# Altium schematic sheet 1_V6.schdoc
size 713 x 330 mm; Name: A_A3; Symbol: A_A3; Device: A_A3; @Project Name: samrtclick; REV: 1; Date: 2023-02-28; Sheet: 1/1; Draw By: kano; Company: Your Company; Convert to PCB: yes; Add into BOM: yes; @Update Date: 2023-06-25; @Page No: 1; @Page Count: 1; @Schematic Name: V6; @Page Name: V6
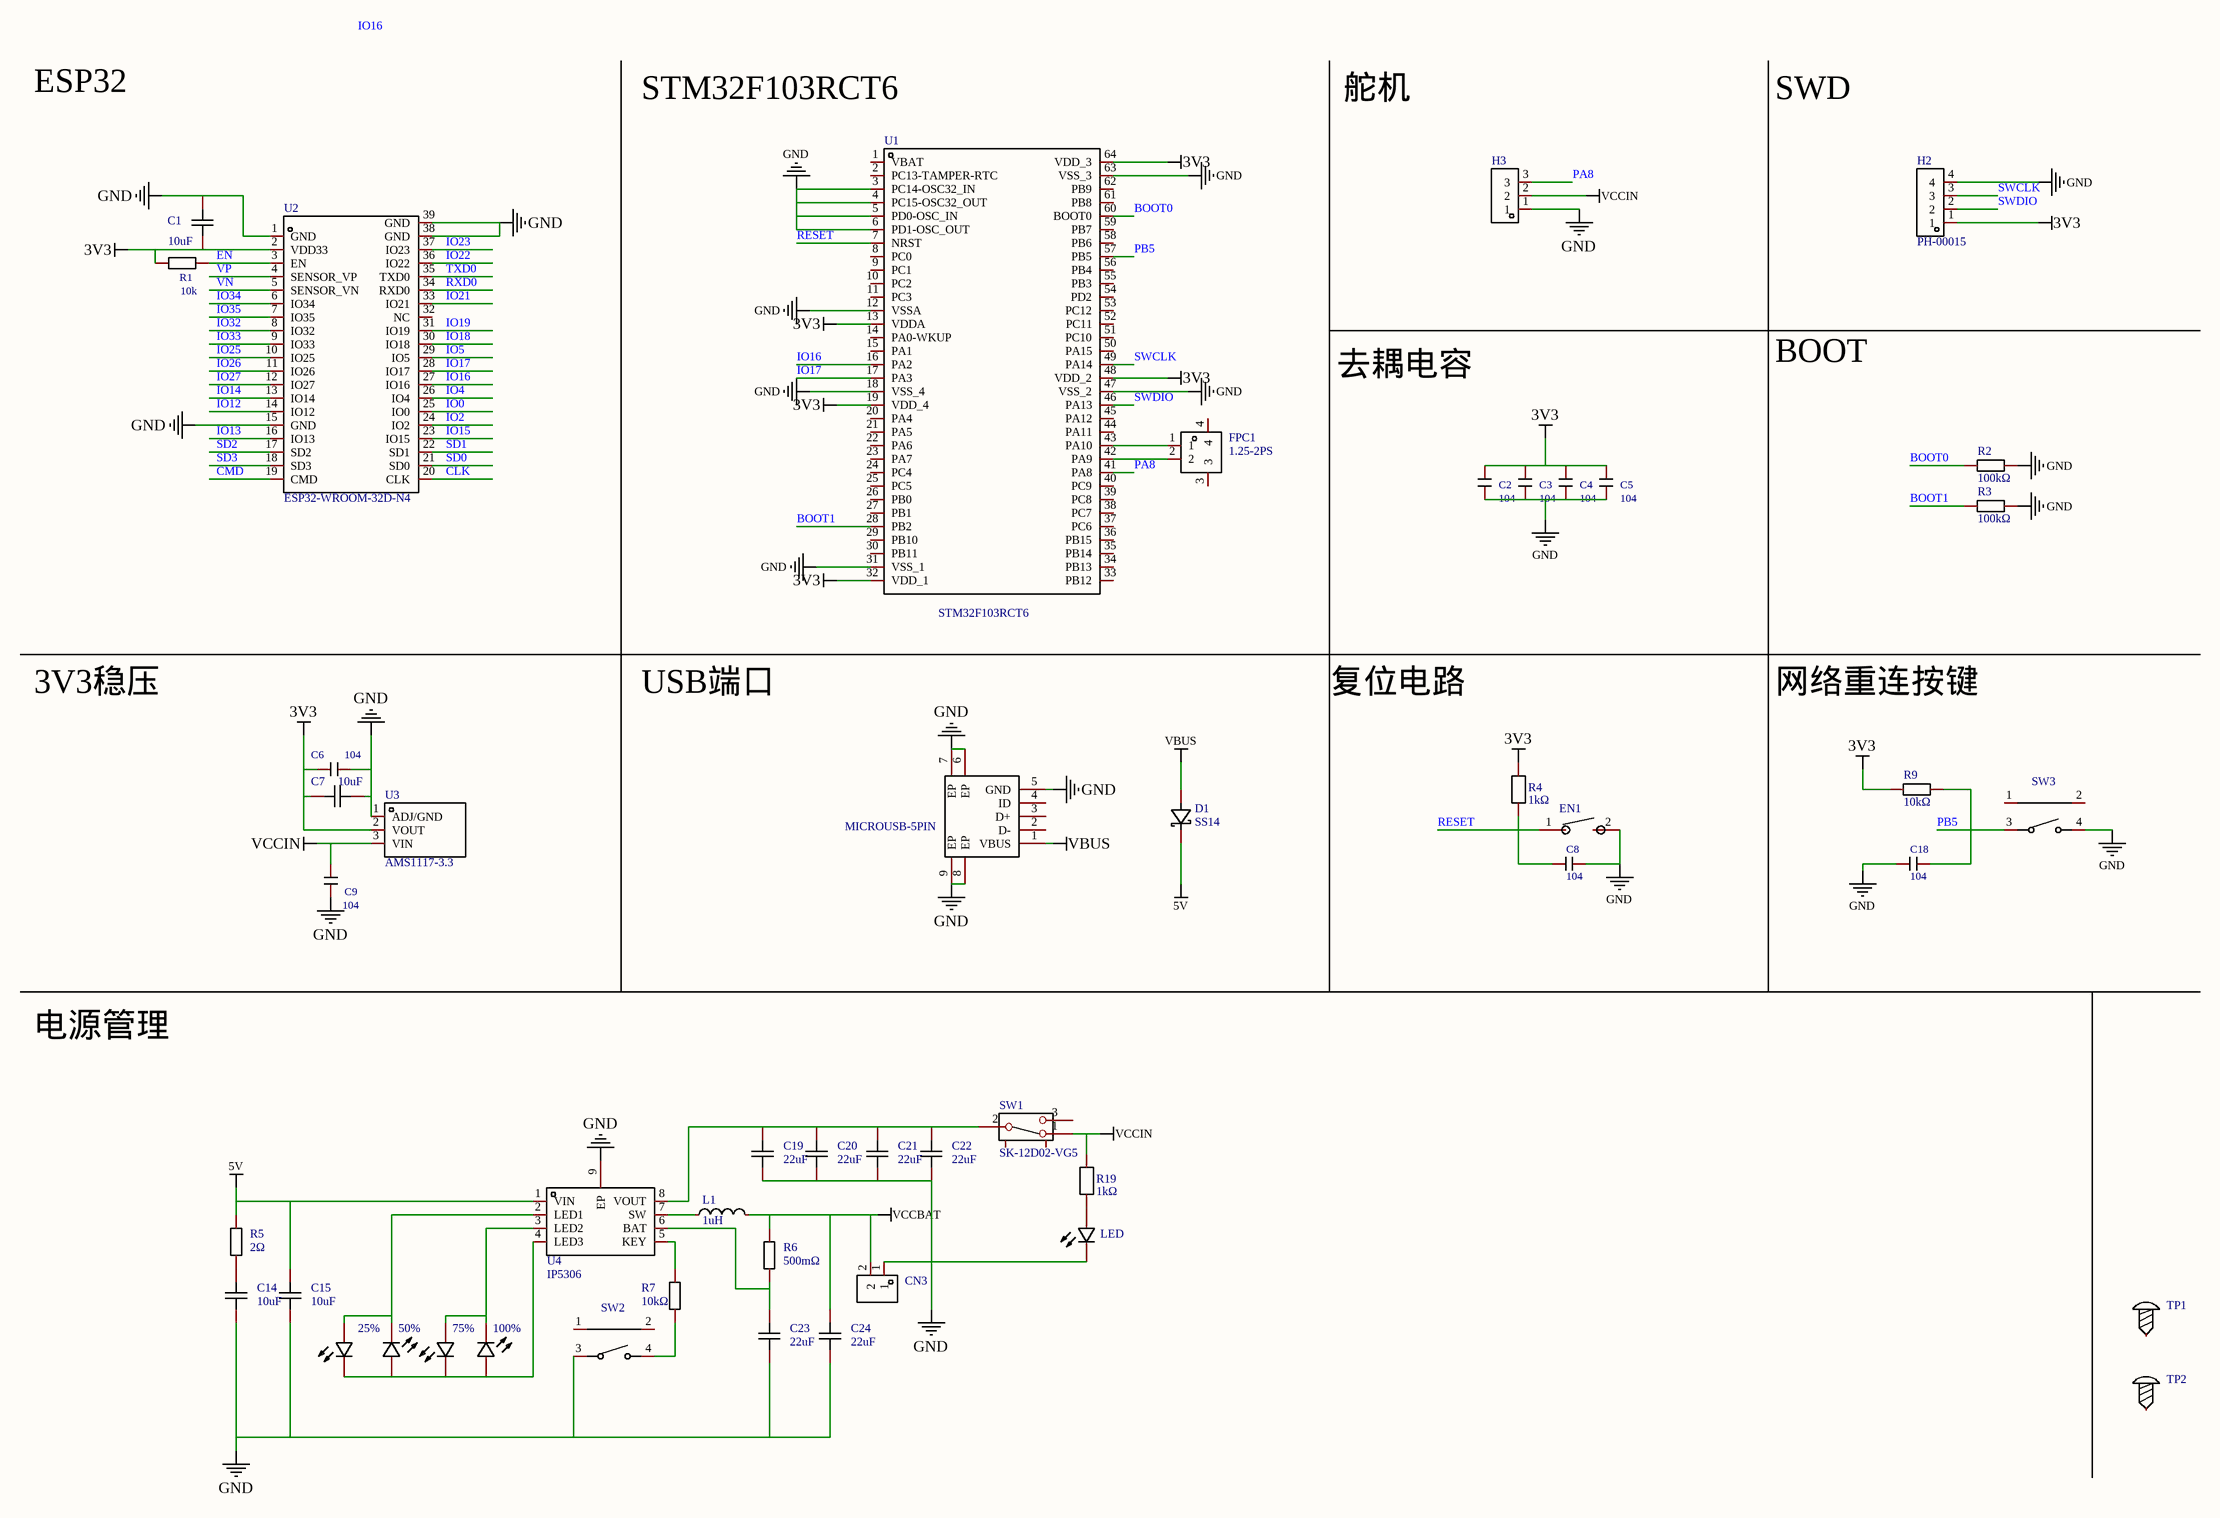
[diagram p0: 1_V6.schdoc]

## Parts
25%  19-217/GHC-YR1S2/3T  [LED0603-RD]  (value not drawn)
50%  19-217/GHC-YR1S2/3T  [LED0603-RD]  (value not drawn)
75%  19-217/GHC-YR1S2/3T  [LED0603-RD]  (value not drawn)
100%  19-217/GHC-YR1S2/3T  [LED0603-RD]  (value not drawn)
C1  10uF  [C0603]
C2  104  [C0603]
C3  104  [C0603]
C4  104  [C0603]
C5  104  [C0603]
C6  104  [C0603]
C7  10uF  [C0805]
C8  104  [C0603]
C9  104  [C0603]
C14  10uF  [C0805]
C15  10uF  [C0805]
C18  104  [C0603]
C19  22uF  [C0805]
C20  22uF  [C0805]
C21  22uF  [C0805]
C22  22uF  [C0805]
C23  22uF  [C0805]
C24  22uF  [C0805]
CN3  HX25003-2A  [CONN-TH_2P-P2.50_HX25003-2A]  (value not drawn)
D1  SS14  [SOD-123FL_L2.8-W1.8-LS3.7-RD]
EN1  TSA343G00-250J2  [SW-SMD_L4.0-W2.9-LS5.0]  (value not drawn)
FPC1  1.25-2PS  [CONN-SMD_2P-P1.25_DEALON_1.25-2PS]
H2  PH-00015  [HDR-TH_4P-P2.54-V-M]
H3  Z-211-0311-0021-001  [HDR-TH_3P-P2.54-V-M-1]  (value not drawn)
L1  1uH  [IND-SMD_L7.0-W6.6]
LED  19-217/GHC-YR1S2/3T  [LED0603-RD]  (value not drawn)
NO1  MICROUSB-5PIN  [USB-SMD_5P_MICROUSB-5PIN]
R1  10k  [R0603]
R2  100kΩ  [R0603]
R3  100kΩ  [R0603]
R4  1kΩ  [R0603]
R5  2Ω  [R0805]
R6  500mΩ  [R1206]
R7  10kΩ  [R0603]
R9  10kΩ  [R0603]
R19  1kΩ  [R0603]
SW1  SK-12D02-VG5  [SW-TH_SK-12D02-VG5]
SW2  TS24CA  [SW-SMD_TS24CA]  (value not drawn)
SW3  TS24CA  [SW-SMD_TS24CA]  (value not drawn)
TP1  M2螺丝  [M2螺丝]  (value not drawn)
TP2  M2螺丝  [M2螺丝]  (value not drawn)
U1  STM32F103RCT6  [LQFP-64_L10.0-W10.0-P0.50-LS12.0-BL]
U2  ESP32-WROOM-32D-N4  [WIFIM-SMD_39P-L25.5-W18.0-P1.27-BL]
U3  AMS1117-3.3  [SOT-89-3_L4.5-W2.5-P1.50-LS4.2-BR]
U4  IP5306  [ESOP-8_L4.9-W3.9-P1.27-LS6.0-BL-EP]

## Nets
3V3: C1.1 C2.1 C3.1 C4.1 C5.1 C6.2 C7.1 H2.1 R1.1 R4.1 R9.2 U1.13(VDDA) U1.19(VDD_4) U1.32(VDD_1) U1.48(VDD_2) U1.64(VDD_3) U2.2(VDD33) U3.2(VOUT)
5V: C15.2 D1.1(A) R5.2 U4.1(VIN)
GND: C1.2 C2.2 C3.2 C4.2 C5.2 C6.1 C7.2 C8.1 C9.1 C14.1 C15.1 C18.1 C19.2 C20.2 C21.2 C22.2 C23.2 C24.2 CN3.1 EN1.2 H2.4 H3.1 LED.1(C) NO1.5(GND) NO1.6(EP) NO1.7(EP) NO1.8(EP) NO1.9(EP) R2.2 R3.2 SW2.3 SW3.4 U1.3(PC14-OSC32_IN) U1.4(PC15-OSC32_OUT) U1.5(PD0-OSC_IN) U1.6(PD1-OSC_OUT) U1.12(VSSA) U1.18(VSS_4) U1.31(VSS_1) U1.47(VSS_2) U1.63(VSS_3) U2.1(GND) U2.15(GND) U2.38(GND) U2.39(GND) U3.1(ADJ/GND) U4.9(EP)
VBUS: D1.2(K) NO1.1(VBUS)
VCCBAT: C24.1 CN3.2 L1.2 R6.2
VCCIN: C9.2 H3.2 R19.1 SW1.1 U3.3(VIN)
BOOT0: R2.1 U1.60(BOOT0)
BOOT1: R3.1 U1.28(PB2)
CLK: U2.20(CLK)
CMD: U2.19(CMD)
EN: R1.2 U2.3(EN)
IO0: U2.25(IO0)
IO2: U2.24(IO2)
IO4: U2.26(IO4)
IO5: U2.29(IO5)
IO12: U2.14(IO12)
IO13: U2.16(IO13)
IO14: U2.13(IO14)
IO15: U2.23(IO15)
IO16: U1.16(PA2) U2.27(IO16)
IO17: U1.17(PA3) U2.28(IO17)
IO18: U2.30(IO18)
IO19: U2.31(IO19)
IO21: U2.33(IO21)
IO22: U2.36(IO22)
IO23: U2.37(IO23)
IO25: U2.10(IO25)
IO26: U2.11(IO26)
IO27: U2.12(IO27)
IO32: U2.8(IO32)
IO33: U2.9(IO33)
IO34: U2.6(IO34)
IO35: U2.7(IO35)
PA8: H3.3 U1.41(PA8)
PB5: C18.2 R9.1 SW3.3 U1.57(PB5)
RESET: C8.2 EN1.1 R4.2 U1.7(NRST)
RXD0: U2.34(RXD0)
SD0: U2.21(SD0)
SD1: U2.22(SD1)
SD2: U2.17(SD2)
SD3: U2.18(SD3)
SWCLK: H2.3 U1.49(PA14)
SWDIO: H2.2 U1.46(PA13)
TXD0: U2.35(TXD0)
VN: U2.5(SENSOR_VN)
VP: U2.4(SENSOR_VP)
Net25%_1: 25%.1(C) 50%.2(A) 75%.1(C) 100%.2(A) U4.4(LED3)
Net25%_2: 25%.2(A) 50%.1(C) U4.2(LED1)
Net75%_2: 75%.2(A) 100%.1(C) U4.3(LED2)
NetC14_2: C14.2 R5.1
NetC19_1: C19.1 C20.1 C21.1 C22.1 SW1.2 U4.8(VOUT)
NetC23_1: C23.1 R6.1 U4.6(BAT)
NetFPC1_1: FPC1.1 U1.43(PA10)
NetFPC1_2: FPC1.2 U1.42(PA9)
NetL1_1: L1.1 U4.7(SW)
NetLED_2: LED.2(A) R19.2
NetR7_1: R7.1 SW2.4
NetR7_2: R7.2 U4.5(KEY)

Not connected (* = marked no-connect by the designer): FPC1 3 4; NO1 2(D-) 3(D+) 4(ID); SW1 3 4 5; SW2 1 2; SW3 1 2; TP1 1; TP2 1; U1 1(VBAT) 2(PC13-TAMPER-RTC) 8(PC0) 9(PC1) 10(PC2) 11(PC3) 14(PA0-WKUP) 15(PA1) 20(PA4) 21(PA5) 22(PA6) 23(PA7) 24(PC4) 25(PC5) 26(PB0) 27(PB1) 29(PB10) 30(PB11) 33(PB12) 34(PB13) 35(PB14) 36(PB15) 37(PC6) 38(PC7) 39(PC8) 40(PC9) 44(PA11) 45(PA12) 50(PA15) 51(PC10) 52(PC11) 53(PC12) 54(PD2) 55(PB3) 56(PB4) 58(PB6) 59(PB7) 61(PB8) 62(PB9); U2 32(NC)

## Notes on the sheet
- ESP32
- STM32F103RCT6
- 舵机
- SWD
- BOOT
- 去耦电容
- 3V3稳压
- USB端口
- 复位电路
- 网络重连按键
- 电源管理
- Labels drawn without touching a wire or pin: IO16
- 2023-06-25
- 1
- V6
- 2
- 3
- 4
- 5
- 6
- 7
- 8
- A
- B
- C
- D
- E
- TITLE:
- REV:
- Date:
- Company:
- Drawn By:
- Sheet:

## Library data of the parts
25% 50% 75% 100% LED = 19-217/GHC-YR1S2/3T: 发光颜色:翠绿;二极管配置:-;主波长:520nm~535nm;色温:-;功率:110mW;安装方式:-;; Manufacturer: EVERLIGHT(亿光); Add into BOM: yes; Emitted Color: 翠绿; Lens Color: 无色透明; Peak Wavelength: 518nm; Forward Current: 20mA; Power Dissipation: 110mW; Viewing Angle: 120°; Name: 19-217/GHC-YR1S2/3T; Symbol: 19-217/GHC-YR1S2/3T; Device: 19-217/GHC-YR1S2/3T; LCSC Part Name: 19-217/GHC-YR1S2/3T; Supplier Part: C72043; Manufacturer Part: 19-217/GHC-YR1S2/3T; Supplier Footprint: 0603; JLCPCB Part Class: Basic Part; Datasheet: https://atta.szlcsc.com/upload/public/pdf/source/20160507/1462613613780.pdf; Supplier: LCSC; Convert to PCB: yes; Diode Configuration: -; Dominant Wavelength: 520nm~535nm; Color Temperature: -; Mounting Sytle: -; Operating Temperature: -40℃~+85℃
C1 = 10uF: 3DModel: C0603_L1.6-W0.8-H0.8; Add into BOM: yes; Name: 10uF; Symbol: 10uF; Device: 10uF; link: https://item.szlcsc.com/362304.html; Convert to PCB: yes; Origin Footprint: C0603
C2-C6 C8 C9 C18 = 104: 3DModel: C0603_L1.6-W0.8-H0.8; BOM名称: 无极性贴片电容; 版权归属: 源创客; Add into BOM: yes; Name: 104; Symbol: 104; Device: 104; link: https://item.szlcsc.com/362304.html; 学习资源: www.ooocke.com; Convert to PCB: yes; Origin Footprint: C0603
C7 = 10uF: 3DModel: C0805_L2.0-W1.3-H1.3; Add into BOM: yes; Name: 10uF; Symbol: 10uF; Device: 10uF; link: https://item.szlcsc.com/373011.html; Convert to PCB: yes; Origin Footprint: C0805
C14 C15 = GRM21BR61H106KE43L: 容值:10uF;精度:±10%;额定电压:50V;材质(温度系数):X5R;; Manufacturer: muRata(村田); Add into BOM: yes; Tolerance: ±10%; Voltage Rated: 50V; Temperature Coefficient: X5R; Name: 10uF; Symbol: GRM21BR61H106KE43L; Device: GRM21BR61H106KE43L; LCSC Part Name: 10uF ±10% 50V; Supplier Part: C440198; Manufacturer Part: GRM21BR61H106KE43L; Supplier Footprint: 0805; JLCPCB Part Class: Basic Part; Datasheet: https://atta.szlcsc.com/upload/public/pdf/source/20191220/C440198_2DEA1B9834E321C8893F7972E9DFE5B0.pdf; Supplier: LCSC; Convert to PCB: yes; Value: 10uF
C19-C24 = C2012X5R1V226MT000E: 容值:22uF;精度:±20%;额定电压:35V;材质(温度系数):X5R;; Manufacturer: TDK; Add into BOM: yes; Tolerance: ±20%; Voltage Rated: 35V; Temperature Coefficient: X5R; Name: 22uF; Symbol: C2012X5R1V226MT000E; Device: C2012X5R1V226MT000E; LCSC Part Name: 22uF ±20% 35V; Supplier Part: C338080; Manufacturer Part: C2012X5R1V226MT000E; Supplier Footprint: 0805; JLCPCB Part Class: Extended Part; Datasheet: https://atta.szlcsc.com/upload/public/pdf/source/20181206/C338080_066671AD469AE9D3706F78911D2065BC.pdf; Supplier: LCSC; Convert to PCB: yes; Value: 22uF
CN3 = HX25003-2A: 参考系列:XH;间距:2.5mm;插针结构:1x2P;排数:1;每排PIN数:2;行距:-;公母:公型插针;安装方式:直插;额定电流:-;工作温度范围:-;; Manufacturer: HX(红星); Add into BOM: yes; Reference Series: XH; Pitch: 2.5mm; Pins Structure: 1x2P; Number of PINs Per Row: 2; Gender: 公型插针; Name: HX25003-2A; Symbol: HX25003-2A; Device: HX25003-2A; LCSC Part Name: XH 2.5mm 1x2P 直插 母座; Supplier Part: C442299; Manufacturer Part: HX25003-2A; Supplier Footprint: 插件,P=2.5mm; JLCPCB Part Class: Extended Part; Datasheet: https://atta.szlcsc.com/upload/public/pdf/source/20191028/C442299_791AF061D32404B3CF2743C2F942DF66.pdf; Supplier: LCSC; Convert to PCB: yes; Number of Rows: 1; Row Spacing: -; Mounting Style: 直插; Current Rating (Max): -; Operating Temperature Range: -
D1 = SS14_C2909920: 二极管配置:-;直流反向耐压(Vr):40V;平均整流电流(Io):1A;正向压降(Vf):550mV@1A;反向电流(Ir):500uA@40V;; Manufacturer: KUU; Add into BOM: yes; Reverse Voltage (Vr): 40V; Average Rectified Current (Io): 1A; Name: SS14; Symbol: SS14_C2909920; Device: SS14_C2909920; LCSC Part Name: 40V 1A 550mV@1A; Supplier Part: C2909920; Manufacturer Part: SS14; Supplier Footprint: SOD-123FL; JLCPCB Part Class: Extended Part; Datasheet: https://atta.szlcsc.com/upload/public/pdf/source/20211028/6407406DF6AAB99A3E103CB6CA1E22D5.pdf; Supplier: LCSC; Convert to PCB: yes; Diode Configuration: -; Forward Voltage (Vf@If): 550mV@1A; Reverse Leakage Current (Ir): 500uA@40V
EN1 = TSA343G00-250J2: 触点电流:50mA;额定电压(DC):12V;绝缘电阻:100MΩ;电路结构:单刀单掷;安装方式:立贴;按钮形状:圆形按钮;按钮/盖帽颜色:黑色;带灯:无;作用力:250gf@±50gf;机械寿命:50000;工作温度:-25℃~+70℃;引脚样式:SMD接片;开关长度:3.95mm;开关宽度:2.9mm;开关高度:2mm;带支架:否;; Manufacturer: BRIGHT(博瑞泰); Add into BOM: yes; Contact Current: 50mA; Voltage Rating (DC): 12V; Insulation Resistance: 100MΩ; Circuit: 单刀单掷; Actuator Style: 圆形按钮; Actuator/Cap Color: 黑色; With Lamp: 无; Mechanical Life: 50000; Pin Style: SMD接片; Switch Length: 3.95mm; Switch Width: 2.9mm; Switch Height: 2mm; Strike Gundam: 否; Actuator Orientation: 顶部触动; 3DModel: SW-SMD_L4.0-W2.9-H2-P4.15-EH; Paste Type: expand; Origin Footprint: SW-SMD_L4.0-W2.9-P4.15-EH; Name: TSA343G00-250J2; Symbol: TSA343G00-250J2; Device: TSA343G00-250J2; LCSC Part Name: 3*4 两脚小龟不带柱  250gf; Supplier Part: C354946; Manufacturer Part: TSA343G00-250J2; Supplier Footprint: SMD; JLCPCB Part Class: Extended Part; Datasheet: https://atta.szlcsc.com/upload/public/pdf/source/20190426/C354946_6B70DFBDFA823D17B8EB46FB9599F693.pdf; Supplier: LCSC; Convert to PCB: yes; Mounting Style: 立贴; Operating Force: 250gf@±50gf; Operating Temperature: -25℃~+70℃; Illumination Color: -; link: https://item.szlcsc.com/457634.html; Assembly Type: smtWeld
FPC1 = 1.25-2PS: 参考系列:-;间距:1.25mm;插针结构:1x2P;排数:1;每排PIN数:2;行距:-;公母:公型插针;安装方式:立贴;额定电流:-;工作温度范围:-65℃~+125℃;; Manufacturer: DEALON(德艺隆); Add into BOM: yes; Pitch: 1.25mm; Pins Structure: 1x2P; Number of PINs Per Row: 2; Gender: 公型插针; Name: 1.25-2PS; Symbol: 1.25-2PS; Device: 1.25-2PS; LCSC Part Name: 1.25mm 1x2P 立贴; Supplier Part: C2904989; Manufacturer Part: 1.25-2PS; Supplier Footprint: SMD,P=1.25mm; JLCPCB Part Class: Extended Part; Datasheet: https://atta.szlcsc.com/upload/public/pdf/source/20211025/ECA073E8D9B866BD290CF6FF3E55D824.pdf; Supplier: LCSC; Convert to PCB: yes; Reference Series: -; Number of Rows: 1; Row Spacing: -; Mounting Style: 立贴; Current Rating (Max): -; Operating Temperature Range: -65℃~+125℃
H2 = PH-00015: 排数:单排;总PIN位数:4;间距:2.54mm;插针结构:1x4P;行距:-;安装类型:直插;圆针/方针:方针;额定电流:3A;额定电压:-;配合针长度:6mm;塑高:2.5mm;端接针长度:3mm;触头材质:-;工作温度范围:-40℃~+105℃;颜色:黑色;; Manufacturer: Liansheng(连盛); Add into BOM: yes; Pitch: 2.54mm; Pin Structure: 1x4P; Circluar Pins/Square Pins: 方针; Current Rating (Max): 3A; Name: PH-00015; Symbol: PH-00015; Device: PH-00015; LCSC Part Name: 2.54mm 1x4P 直插 方针; Supplier Part: C2829888; Manufacturer Part: PH-00015; Supplier Footprint: 直插,P=2.54mm; JLCPCB Part Class: Extended Part; Datasheet: https://atta.szlcsc.com/upload/public/pdf/source/20210507/C2829888_39A693133DEF85B8C06C0B5A72669F0A.pdf; Supplier: LCSC; Convert to PCB: yes; Number of Rows: 单排; Number of Pins: 4; Row Spacing: -; Mounting Type: 直插; Voltage Rating (Max): -; Length of Mating Pin: 6mm; Insulation Height: 2.5mm; Length of End Connection Pin: 3mm; Contact Material: -; Operating Temperature Range: -40℃~+105℃; Color: 黑色
H3 = Z-211-0311-0021-001: Manufacturer: Nextron(正凌); 3DModel: HDR-M-2.54_1x3; Add into BOM: yes; Name: Z-211-0311-0021-001; Symbol: Z-211-0311-0021-001; Device: Z-211-0311-0021-001; link: https://item.szlcsc.com/50265.html; Supplier: LCSC; Manufacturer Part: Z-211-0311-0021-001; Supplier Part: C152153; JLCPCB Part Class: Extended Part; Convert to PCB: yes; Origin Footprint: HDR-TH_3P-P2.54-V-M-1
L1 = FXL0618-1R0-M: 电感值:1uH;精度:±20%;额定电流:8.5A;饱和电流(Isat):14A;; Manufacturer: cjiang(长江微电); Add into BOM: yes; Tolerance: ±20%; Rated Current: 8.5A; Saturation Current (Isat): 14A; DC Resistance (DCR): 13mΩ; Name: 1uH; Symbol: FXL0618-1R0-M; Device: FXL0618-1R0-M; LCSC Part Name: 1uH ±20% 8.5A 13mΩ; Supplier Part: C524591; Manufacturer Part: FXL0618-1R0-M; Supplier Footprint: SMD,6.6x7mm; JLCPCB Part Class: Extended Part; Datasheet: https://atta.szlcsc.com/upload/public/pdf/source/20200117/C485363_A2440626DC7482D75DD0DD56D1883FBF.pdf; Supplier: LCSC; Convert to PCB: yes; Value: 1uH
NO1 = MICROUSB-5PIN: Add into BOM: yes; Name: MICROUSB-5PIN; Symbol: MICROUSB-5PIN; Device: MICROUSB-5PIN; link: https://wenku.baidu.com/view/86fe0d6b3968011ca200912d.html; 3DModel: USB-SMD_5P_MICROUSB-5PIN; Supplier: LCSC; Supplier Part: C9900001196; Manufacturer Part: MicroUSB-5PIN; JLCPCB Part Class: Extended Part; Convert to PCB: yes; Origin Footprint: USB-SMD_5P_MICROUSB-5PIN; NO_CONNECT: yes
R1 = 10k: BOM名称: 贴片电阻; 版权归属: 源创客; Add into BOM: yes; Name: 10k; Symbol: 10k; Device: 10k; 3DModel: R0603; link: https://www.mouser.in/datasheet/2/447/PYu_RT_1_to_0_01_RoHS_L_11-1669912.pdf; 学习资源: www.ooocke.com; Convert to PCB: yes; Origin Footprint: R0603
R2 R3 = 0603WAF1003T5E: 电阻类型:厚膜电阻;阻值:100kΩ;精度:±1%;功率:100mW;; Manufacturer: UNI-ROYAL(厚声); Add into BOM: yes; Tolerance: ±1%; Power(Watts): 100mW; Temperature Coefficient: ±100ppm/℃; Overload Voltage (Max): 75V; Name: 100kΩ; Symbol: 0603WAF1003T5E; Device: 0603WAF1003T5E; LCSC Part Name: 100kΩ ±1% 100mW; Supplier Part: C25803; Manufacturer Part: 0603WAF1003T5E; Supplier Footprint: 0603; JLCPCB Part Class: Basic Part; Datasheet: https://atta.szlcsc.com/upload/public/pdf/source/20200306/C422600_1E6D84923E4A46A82E41ADD87F860B5C.pdf; Supplier: LCSC; Convert to PCB: yes; Type: 厚膜电阻; Value: 100kΩ; Operating Temperature Range: -55℃~+155℃
R4 R19 = ERA3VEB1001V: 温度系数:±25ppm/K;温度系数:±25ppm/K;工作温度范围:-55℃~+155℃;工作温度范围:-55℃~+155℃;精度:±0.1%;最大工作电压:100V;类型:薄膜电阻;功率:125mW;阻值:1kΩ;; Manufacturer: PANASONIC(松下); Add into BOM: yes; Tolerance: ±0.1%; Overload Voltage (Max): 100V; Power(Watts): 125mW; 3DModel: R0603_L1.6-W0.8-H0.8; Name: 1kΩ; Symbol: ERA3VEB1001V; Device: ERA3VEB1001V; LCSC Part Name: 1KΩ(1001) ±0.1%; Supplier Part: C490794; Manufacturer Part: ERA3VEB1001V; Supplier Footprint: 0603; JLCPCB Part Class: Extended Part; Datasheet: https://atta.szlcsc.com/upload/public/pdf/source/20200407/C490794_144E786BD6B5906C11E86C00580B1EF5.pdf; Supplier: LCSC; Convert to PCB: yes; Temperature Coefficient: ±25ppm/K; Operating Temperature Range: -55℃~+155℃; Type: 薄膜电阻; Value: 1kΩ; link: https://item.szlcsc.com/137208.html; Origin Footprint: R0603
R5 = 0805W8F200KT5E: 电阻类型:厚膜电阻;阻值:2Ω;精度:±1%;功率:125mW;; Manufacturer: UNI-ROYAL(厚声); Add into BOM: yes; Tolerance: ±1%; Power(Watts): 125mW; Temperature Coefficient: ±400ppm/℃; Overload Voltage (Max): 150V; Name: 2Ω; Symbol: 0805W8F200KT5E; Device: 0805W8F200KT5E; LCSC Part Name: 2Ω ±1% 125mW; Supplier Part: C17606; Manufacturer Part: 0805W8F200KT5E; Supplier Footprint: 0805; JLCPCB Part Class: Basic Part; Datasheet: https://atta.szlcsc.com/upload/public/pdf/source/20200306/C422600_1E6D84923E4A46A82E41ADD87F860B5C.pdf; Supplier: LCSC; Convert to PCB: yes; Type: 厚膜电阻; Value: 2Ω; Operating Temperature Range: -55℃~+155℃
R6 = 1206W4F500LT5E: 电阻类型:厚膜电阻;阻值:500mΩ;精度:±1%;功率:250mW;; Manufacturer: UNI-ROYAL(厚声); Add into BOM: yes; Tolerance: ±1%; Power(Watts): 250mW; Temperature Coefficient: ±800ppm/℃; Overload Voltage (Max): 200V; Name: 500mΩ; Symbol: 1206W4F500LT5E; Device: 1206W4F500LT5E; LCSC Part Name: 500mΩ ±1% 250mW; Supplier Part: C25340; Manufacturer Part: 1206W4F500LT5E; Supplier Footprint: 1206; JLCPCB Part Class: Extended Part; Datasheet: https://atta.szlcsc.com/upload/public/pdf/source/20200306/C422600_1E6D84923E4A46A82E41ADD87F860B5C.pdf; Supplier: LCSC; Convert to PCB: yes; Type: 厚膜电阻; Value: 500mΩ; Operating Temperature Range: -55℃~+155℃
R7 R9 = 0603WAF1002T5E: 电阻类型:厚膜电阻;阻值:10kΩ;精度:±1%;功率:100mW;; Manufacturer: UNI-ROYAL(厚声); Add into BOM: yes; Tolerance: ±1%; Power(Watts): 100mW; Temperature Coefficient: ±100ppm/℃; Overload Voltage (Max): 75V; Name: 10kΩ; Symbol: 0603WAF1002T5E; Device: 0603WAF1002T5E; LCSC Part Name: 厚膜电阻 10kΩ ±1% 100mW; Supplier Part: C25804; Manufacturer Part: 0603WAF1002T5E; Supplier Footprint: 0603; JLCPCB Part Class: Basic Part; Datasheet: https://atta.szlcsc.com/upload/public/pdf/source/20200306/C422600_1E6D84923E4A46A82E41ADD87F860B5C.pdf; Supplier: LCSC; Convert to PCB: yes; Type: 厚膜电阻; Value: 10kΩ; Operating Temperature Range: -55℃~+155℃
SW1 = SK-12D02-VG5_C136722: 额定电流(DC):-;额定电压(DC):-;额定电流(AC):-;额定电压(AC):-;电路结构:单刀双掷;安装方式:卧插;机械寿命:5000;滑钮形状:矩形柱状;引脚样式:PC引脚;工作温度:-25℃~+70℃;开关高度:9.5mm;; Manufacturer: 韩国韩荣; Add into BOM: yes; Circuit: 单刀双掷; Mechanical Life: 5000; Actuator Style: 矩形柱状; Pin Style: PC引脚; Switch Height: 9.5mm; Name: SK-12D02-VG5; Symbol: SK-12D02-VG5; Device: SK-12D02-VG5_C136722; LCSC Part Name: SK-12D02-VG5; Supplier Part: C136722; Manufacturer Part: SK-12D02-VG5; Supplier Footprint: 插件; JLCPCB Part Class: Extended Part; Datasheet: https://atta.szlcsc.com/upload/public/pdf/source/20180731/C136723_39114FC09BF2E9DC98823B78B7234B45.pdf; Supplier: LCSC; Convert to PCB: yes; Current Rating (DC): -; Voltage Rating (DC): -; Current Rating (AC): -; Voltage Rating (AC): -; Mounting Style: 卧插; Operating Temperature: -25℃~+70℃
SW2 SW3 = TS24CA: 触点电流:50mA;额定电压(DC):12V;电路结构:单刀单掷;安装方式:卧贴;带灯:-;机械寿命:-;; Manufacturer: SHOU HAN(首韩); Add into BOM: yes; Contact Current: 50mA; Voltage Rating (DC): 12V; Circuit: 单刀单掷; Actuator Style: 矩形按钮; Switch Length: 4.55mm; Switch Width: 1.8mm; Switch Height: 3.5mm; Name: TS24CA; Symbol: TS24CA; Device: TS24CA; LCSC Part Name: 4.55*1.8*3.5mm 卧贴 轻触开关; Supplier Part: C393942; Manufacturer Part: TS24CA; Supplier Footprint: SMD; JLCPCB Part Class: Extended Part; Datasheet: https://atta.szlcsc.com/upload/public/pdf/source/20190521/C393942_591A9E318887EFA4274D34029981AD99.pdf; Supplier: LCSC; Convert to PCB: yes; Mounting Style: 卧贴; With Lamp: -; Mechanical Life: -
TP1 TP2 = M2螺丝: Symbol: 螺丝孔; Convert to PCB: yes; Device: M2螺丝; Add into BOM: yes; Supplier Footprint: 插件
U1 = STM32F103RCT6: 工作电压:2V ~ 3.6V;主频（MAX):72MHz;; Manufacturer: ST(意法半导体); Add into BOM: yes; UART/USART: 3 USART+2 UART; SPI: 3; USB Device: 1; PWM: 18; LCD: LCD parallel interface, 8080/6800 modes; I2C（SMBUS/PMBUS）: 2; A/D: 16x12bit; D/A: 2x12bit; Program Memory Size: 256KB; RAM Size: 48KB; Speed: 72MHz; Number of I/O: 51; Name: STM32F103RCT6; Symbol: STM32F103RCT6; Device: STM32F103RCT6; LCSC Part Name: STM32F103RCT6; Supplier Part: C8323; Manufacturer Part: STM32F103RCT6; Supplier Footprint: LQFP-64_10x10x05P; JLCPCB Part Class: Basic Part; Datasheet: https://atta.szlcsc.com/upload/public/pdf/source/20161130/1480498797345.pdf; Supplier: LCSC; Convert to PCB: yes; Voltage - Supply (Vcc/Vdd): 2V ~ 3.6V; CAN: 1
U2 = ESP32-WROOM-32D-N4_C473012: ESP32-WROOM-32D 集成 ESP32-D0WD，功能强大，用途广泛，可以用于低功耗传感器网络和要求极高的任务，例如语音编码、音频流和 MP3 解码等。; Manufacturer: ESPRESSIF(乐鑫); Add into BOM: yes; Name: ESP32-WROOM-32D-N4; Symbol: ESP32-WROOM-32D; Device: ESP32-WROOM-32D-N4_C473012; LCSC Part Name: ESP32-WROOM-32D-N4; Supplier Part: C473012; Manufacturer Part: ESP32-WROOM-32D-N4; Supplier Footprint: SMD,18x25.5mm; JLCPCB Part Class: Extended Part; Datasheet: https://atta.szlcsc.com/upload/public/pdf/source/20191225/C473012_1E74417EE995DBCF17C94BD318A37DAB.pdf; Supplier: LCSC; Convert to PCB: yes; NO_CONNECT: yes
U3 = AMS1117-3.3_C880752: 输出类型:-;; Manufacturer: Slkor(萨科微); Add into BOM: yes; Name: AMS1117-3.3; Symbol: AMS1117-3.3_C880752; Device: AMS1117-3.3_C880752; LCSC Part Name: AMS1117-3.3; Supplier Part: C880752; Manufacturer Part: AMS1117-3.3; Supplier Footprint: SOT-89-3; JLCPCB Part Class: Extended Part; Datasheet: https://atta.szlcsc.com/upload/public/pdf/source/20201231/C426566_7F22DB93439D00F3FA27143E4F28C6AA.pdf; Supplier: LCSC; Convert to PCB: yes; Output Type: -
U4 = IP5306: 2.1A充电2.4A放电高集成度移动电源SOC; Manufacturer: INJOINIC(英集芯); Add into BOM: yes; Name: IP5306; Symbol: IP5306; Device: IP5306; LCSC Part Name: IP5306; Supplier Part: C181692; Manufacturer Part: IP5306; Supplier Footprint: ESOP-8; JLCPCB Part Class: Extended Part; Datasheet: https://atta.szlcsc.com/upload/public/pdf/source/20180920/C181692_842C9BF636DF123BB66E91FC1AD6F13F.pdf; Supplier: LCSC; Convert to PCB: yes